# EAGLE schematic 555-dev (EAGLE 7.4.0)
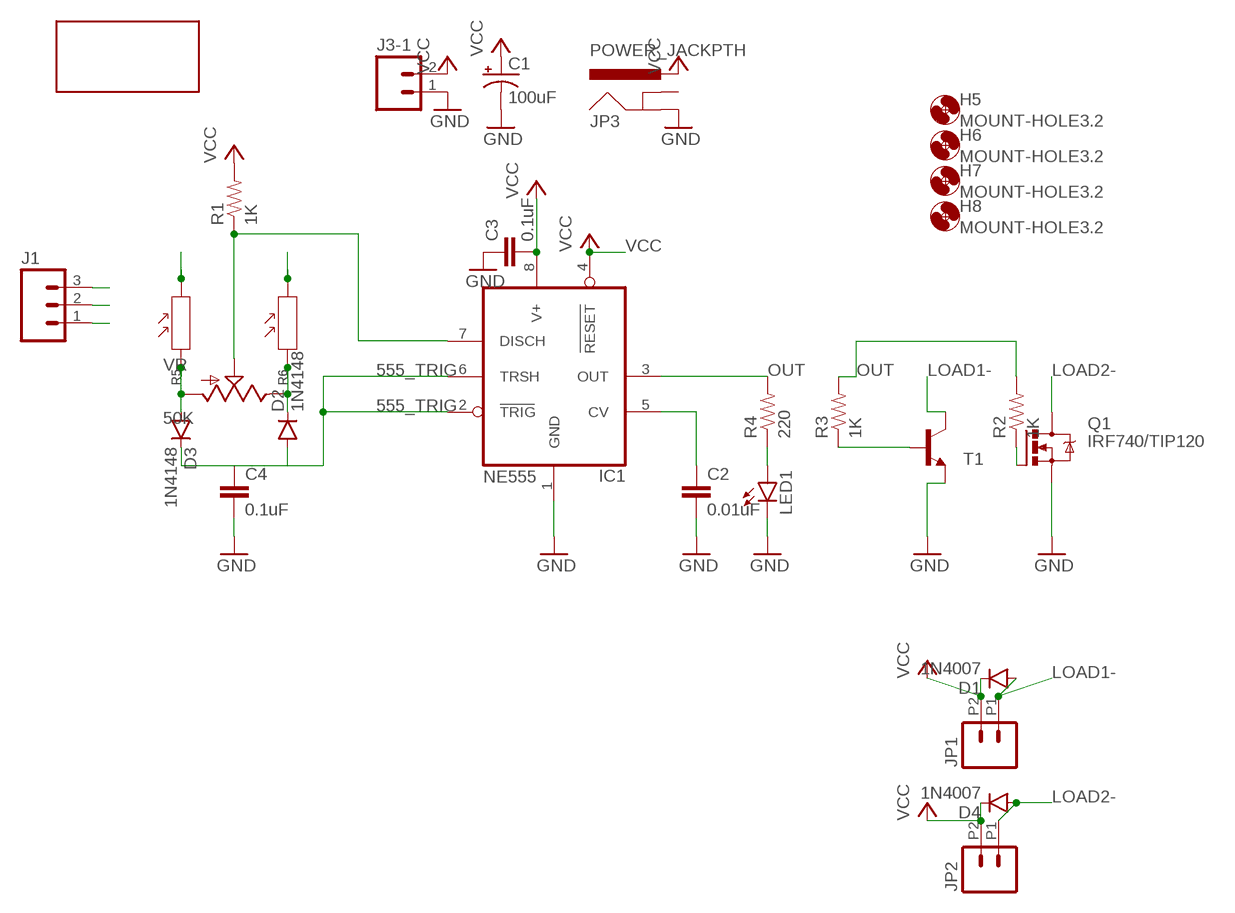
[diagram p0: schematic, sheet 1]

## Parts
C1  100uF  CAP_POLPTH1  [CPOL-RADIAL-100UF-25V]
C2  0.01uF  CAPPTH1  [CAP-PTH-5MM]
C3  0.1uF  CAPPTH1  [CAP-PTH-5MM]
C4  0.1uF  CAPPTH1  [CAP-PTH-5MM]
D1  1N4007  DIODEKIT  [DIODE-1N4148-KIT]
D2  1N4148  DIODE1N4148  [DIODE-1N4148]
D3  1N4148  DIODE1N4148  [DIODE-1N4148]
D4  1N4007  DIODEKIT  [DIODE-1N4148-KIT]
H5  MOUNT-HOLE3.2  [3,2]
H6  MOUNT-HOLE3.2  [3,2]
H7  MOUNT-HOLE3.2  [3,2]
H8  MOUNT-HOLE3.2  [3,2]
IC1  NE555  TLC555  [DIL08]
J1  M03PTH  [1X03]
J3-1  M02PTH  [1X02]
JP1  M022.54MM_SCREWTERM  [1X02_2.54_SCREWTERM]
JP2  M022.54MM_SCREWTERM  [1X02_2.54_SCREWTERM]
JP3  POWER_JACKPTH  [POWER_JACK_PTH]
LED1  LED5MM-KIT  [LED5MM-KIT]
Q1  IRF740/TIP120  IRF740  [TO220BV]
R1  1K  RESISTORPTH-1/4W  [AXIAL-0.4]
R2  1K  RESISTORPTH-1/4W  [AXIAL-0.4]
R3  1K  RESISTORPTH-1/4W  [AXIAL-0.4]
R4  220  RESISTORPTH-1/4W  [AXIAL-0.4]
R5  R-PHOTOVARISTOR'0546'  [0546/3.3]
R6  R-PHOTOVARISTOR'0546'  [0546/3.3]
T1  2N2222  [TO92-EBC-OVAL]
U$1  LOGO  [LOGO]
VR  50K  POTALPS-KIT  [ALPS_POT_KIT]

## Nets
555_DISCH: IC1.7(DISCH) J1.2 R1.P$1 VR.P$2(S)
555_TRIG: C4.1 D2.A D3.C IC1.2(TRIG) IC1.6(TRSH)
GND: C1.2(-) C2.2 C3.1 C4.2 IC1.1(GND) J3-1.1 JP3.GND LED1.K(C) Q1.S T1.E
LOAD1-: D1.A JP1.P1 T1.C
LOAD2-: D4.A JP2.P1 Q1.D
N$1: Q1.G R2.P$1
N$2: D2.C R6.P$1 VR.P$1(E)
N$3: D3.A R5.P$1 VR.P$3(A)
N$5: C2.1 IC1.5(CV)
N$7: R3.P$1 T1.B
N$9: LED1.A R4.P$1
OUT: IC1.3(OUT) R2.P$2 R3.P$2 R4.P$2
PR1: J1.1 R5.P$2
PR2: J1.3 R6.P$2
VCC: C1.1(+) C3.2 D1.C D4.C IC1.4(RESET) IC1.8(V+) J3-1.2 JP1.P2 JP2.P2 JP3.PWR R1.P$2
Unconnected: JP3.GNDBREAK

## Library data of the parts
C1 = SparkFun-Capacitors:CAP_POL: Capacitor Polarized These are standard SMD and PTH capacitors. Normally 10uF, 47uF, and 100uF in electrolytic and tantalum varieties. Always verify the external diameter of the through hole cap, it varies with capacity, voltage, and manufacturer. The EIA devices should be standard.
C2-C4 = SparkFun-Passives:CAP: Capacitor Standard 0603 ceramic capacitor, and 0.1" leaded capacitor.
D1 D4 = SparkFun-DiscreteSemi:DIODE: Diode These are standard reverse protection diodes and small signal diodes. SMA package can handle up to about 1A. SOD-323 can handle about 200mA. What the SOD-323 package when ordering, there are some mfgs out there that are 5-pin packages.
D2 D3 = SparkFun-DiscreteSemi:DIODE: Diode These are standard reverse protection diodes and small signal diodes. SMA package can handle up to about 1A. SOD-323 can handle about 200mA. What the SOD-323 package when ordering, there are some mfgs out there that are 5-pin packages.; PROD_ID: DIO-08378
H5-H8 = holes:MOUNT-HOLE: MOUNTING HOLE with drill center marker
IC1 = SUC:TLC555: TIMER
J1 = SparkFun-Connectors:M03: Header 3 Standard 3-pin 0.1" header. Use with straight break away headers (SKU : PRT-00116), right angle break away headers (PRT-00553), swiss pins (PRT-00743), machine pins (PRT-00117), and female headers (PRT-00115). Molex polarized connector foot print use with SKU : PRT-08232 with associated crimp pins and housings.
J3-1 JP1 JP2 = SparkFun-Connectors:M02: Standard 2-pin 0.1" header. Use with - straight break away headers ( PRT-00116) - right angle break away headers (PRT-00553) - swiss pins (PRT-00743) - machine pins (PRT-00117) - female headers (PRT-00115) Molex polarized connector foot print use with: PRT-08233 with associated crimp pins and housings. 2.54_SCREWTERM for use with PRT-10571. 3.5mm Screw Terminal footprints for PRT-08084 5mm Screw Terminal footprints for use with PRT-08432
JP3 = SparkFun-Connectors:POWER_JACK: Power Jack This is the standard 5.5mm barrel jack for power. The PTH is the most common, proven, reliable, footprint. The Slot footprint only works if the mill layer is transmitted to the PCB fab house so be warned. Mating wall wart : TOL-00298 (and others); PROD_ID: CONN-08197
LED1 = SparkFun-LED:LED: LEDs Standard schematic elements and footprints for 5mm, 3mm, 1206, and 0603 sized LEDs. 5mm - Spark Fun Electronics SKU : COM-00529 (and others)
Q1 = transistor-power:IRF740: N-CHANNEL MOS FET
R1-R4 = SparkFun-Resistors:RESISTOR: Resistor Basic schematic elements and footprints for 0603, 1206, and PTH resistors.
R5 R6 = Discrete:R-PHOTOVARISTOR: Photovaristor
T1 = adafruit:2N2222: NPN TRANSISTOR Big oval pads
U$1 = SparkFun-Electromechanical:LOGO
VR = SparkFun-Electromechanical:POT; PROD_ID: RES-09177